# Altium project Fullness_detector.PrjPcb
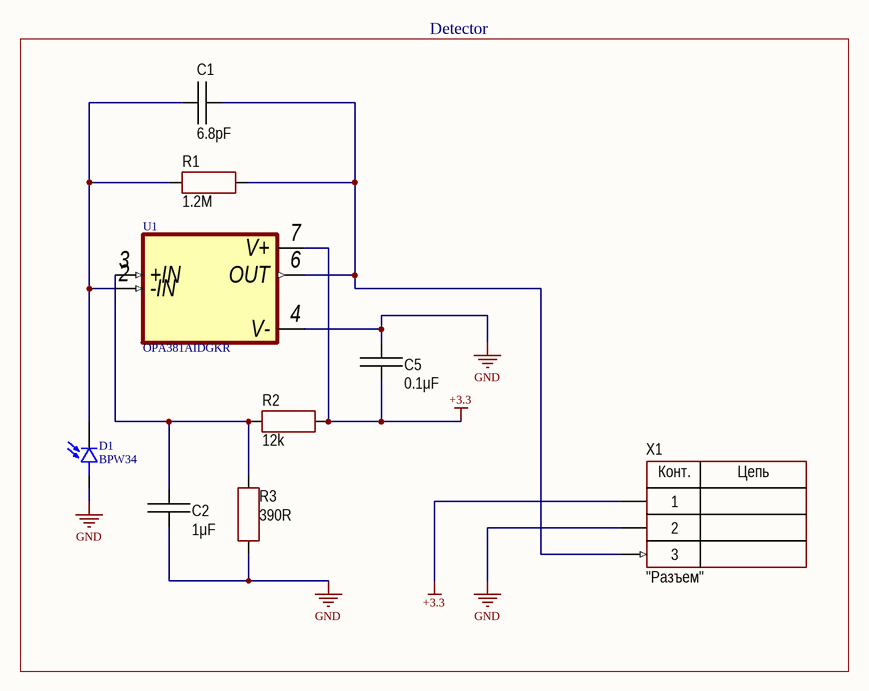
[diagram p0: detector.SchDoc]
1 sheet, 9 parts. Net scope: global (net labels, ports and power ports of the same name join across sheets).
Board file: detector.PcbDoc

## Sheet detector.SchDoc
size 209 x 297 mm; Author: Васильев И.А.; Organization: МГТУ им.Баумана; SheetNumber: 1; SheetTotal: 1

### Parts
C1  value 6.8pF  [CAP: 0805]
C2  value 1μF  [CAP: 0805]
C5  value 0.1μF  [CAP: 0805]
D1  BPW34  [DIO_BPW34]
R1  value 1.2M  [RES: 0805]
R2  value 12k  [RES: 0805]
R3  value 390R  [RES: 0805]
U1  OPA381AIDGKR  [SOP65P490X110-8N]
X1  CommentText: "Разъем"  [CON: PLS-3R]

### Blocks framed on the sheet
Detector: C1 C2 C5 D1 R1-R3 U1 X1

### Nets
+3.3: C5.1 R2.2 U1.7(V+) X1.1
GND: C2.1 C5.2 D1.A R3.1 U1.4(V-) X1.2
NetC1_1: C1.1 R1.2 U1.6(OUT) X1.3
NetC1_2: C1.2 D1.C R1.1 U1.2(-IN)
NetC2_2: C2.2 R2.1 R3.2 U1.3(+IN)

### Notes on the sheet
- Перв. примен.
- Справ. №
- Подп. и дата
- Инв. № дубл.
- Взам. инв. №
- Разраб.
- Изм.
- Лист
- № докум.
- Подп.
- Дата
- Литера
- Масса
- Масштаб
- Пров.
- Т.контр.
- Листов
- Инв. № подл.
- Н.контр.
- Утв.
- Форма 1 ГОСТ 2.104-2006
- Копировал
- Формат А4
- (in symbol PLS-3R) Конт.; Цепь

### Library data of the parts
C1 = Ceramic_0805: Manufacturer: Yageo; PartNumber: CC0805KRX7R7BB104; ValueManufacturerPartNumber: Ceramic capacitor, 6.8pF, X7R, ±10%, 16V, 0805, -55...+125°C; TypeCapacitor: Ceramic capacitor; Tolerance: ±10%; TypeDielectric: X7R; Voltage: 16V; Package: 0805; HelpURL: https://www.digikey.com/product-detail/en/yageo/CC0805KRX7R7BB104/311-1142-1-ND/303052; Temperature: -55...+125°C
C2 = Ceramic_0805: Manufacturer: Yageo; PartNumber: CC0805KRX7R7BB104; ValueManufacturerPartNumber: Ceramic capacitor, 1μF, X7R, ±10%, 16V, 0805, -55...+125°C; TypeCapacitor: Ceramic capacitor; Tolerance: ±10%; TypeDielectric: X7R; Voltage: 16V; Package: 0805; HelpURL: https://www.digikey.com/product-detail/en/yageo/CC0805KRX7R7BB104/311-1142-1-ND/303052; Temperature: -55...+125°C
C5 = Ceramic_0805: Manufacturer: Yageo; PartNumber: CC0805KRX7R7BB104; ValueManufacturerPartNumber: Ceramic capacitor, 0.1μF, X7R, ±10%, 16V, 0805, -55...+125°C; TypeCapacitor: Ceramic capacitor; Tolerance: ±10%; TypeDielectric: X7R; Voltage: 16V; Package: 0805; HelpURL: https://www.digikey.com/product-detail/en/yageo/CC0805KRX7R7BB104/311-1142-1-ND/303052; Temperature: -55...+125°C
D1 = BPW34: Photodiode 850nm 20ns 120Â° 2-DIP (0.213, 5.40mm); MF: OSRAM Opto Semiconductors; SnapEDA_Link: https://www.snapeda.com/parts/BPW%2034/OSRAM/view-part/?ref=snap; Package: SMD-2 OSRAM Opto Semiconductors; Value: *; MP: BPW 34; Check_prices: https://www.snapeda.com/parts/BPW%2034/OSRAM/view-part/?ref=eda; PartNumber: BPW34
R1 = Resistor_0805: Manufacturer: Yageo; PartNumber: RC0805JR-07100RL; ValueManufacturerPartNumber: Resistor film, 1.2M, ±5%, 0805, 0.125W, -55...+125°C; TypeResistor: Resistor film; Power: 0.125W; Tolerance: ±5%; Package: 0805; HelpURL: https://www.digikey.com/product-detail/en/yageo/RC0805JR-07100RL/311-100ARCT-ND/731185; Temperature: -55...+125°C
R2 = Resistor_0805: Manufacturer: Yageo; PartNumber: RC0805JR-07100RL; ValueManufacturerPartNumber: Resistor film, 12k, ±5%, 0805, 0.125W, -55...+125°C; TypeResistor: Resistor film; Power: 0.125W; Tolerance: ±5%; Package: 0805; HelpURL: https://www.digikey.com/product-detail/en/yageo/RC0805JR-07100RL/311-100ARCT-ND/731185; Temperature: -55...+125°C
R3 = Resistor_0805: Manufacturer: Yageo; PartNumber: RC0805JR-07100RL; ValueManufacturerPartNumber: Resistor film, 390R, ±5%, 0805, 0.125W, -55...+125°C; TypeResistor: Resistor film; Power: 0.125W; Tolerance: ±5%; Package: 0805; HelpURL: https://www.digikey.com/product-detail/en/yageo/RC0805JR-07100RL/311-100ARCT-ND/731185; Temperature: -55...+125°C
U1 = OPA381AIDGKR: Precision, Low Power, High-Speed Transimpedance Amplifier; PartNumber: OPA381; MF: Texas Instruments; SnapEDA_Link: https://www.snapeda.com/parts/OPA381AIDGKR/Texas+Instruments/view-part/?ref=snap; Package: VSSOP-8 Texas Instruments; Value: *; MP: OPA381AIDGKR; Check_prices: https://www.snapeda.com/parts/OPA381AIDGKR/Texas+Instruments/view-part/?ref=eda
X1 = PLS-3R: Manufacturer: Connfly; ValueManufacturerPartNumber: Connector, 3pin, 2.54mm, 500VAC, 3A; TypeConnector: Connector; VoltageMax: 500VAC; Pitch: 2.54mm; CurrentMax: 3A; Multichannel: 3pin; HelpURL: https://www.chipdip.ru/product/pls-3; PartNumber: PLS-3R